# Altium schematic sheet Power.SchDoc
size A4
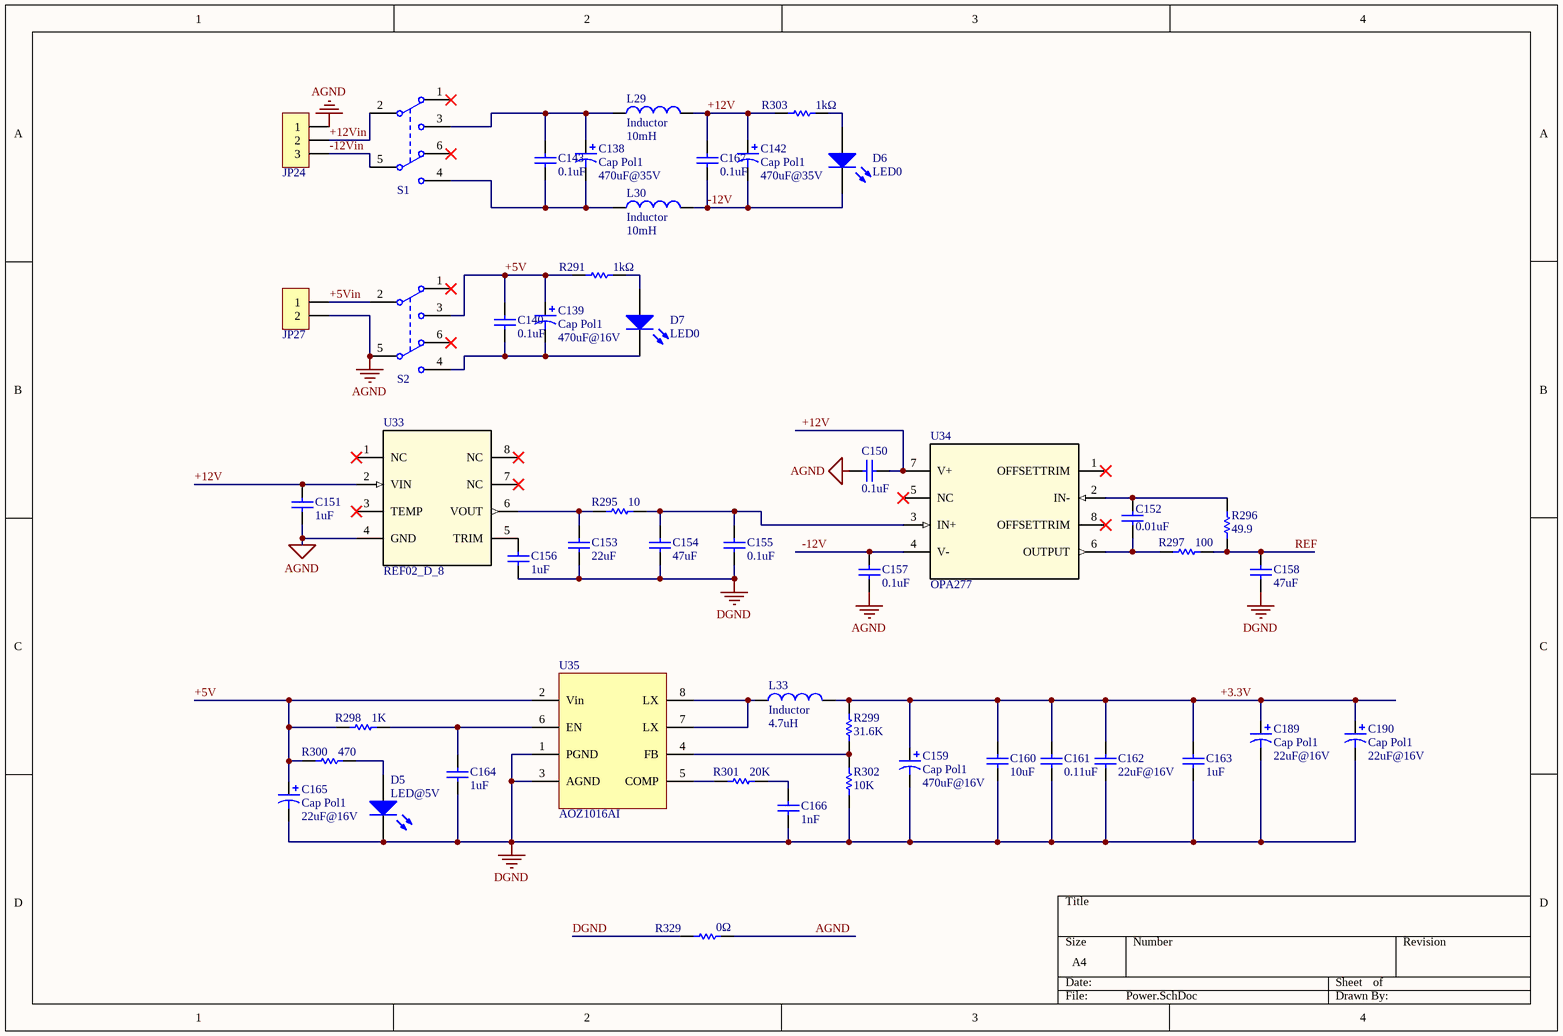
[diagram p0: Power.SchDoc]

## Parts
C138  Cap Pol1  value 470uF@35V  [RB7.6-15]
C139  Cap Pol1  value 470uF@16V  [RB7.6-15]
C140  value 0.1uF  [1608[0603]]  (hidden comment: Cap)
C142  Cap Pol1  value 470uF@35V  [RB7.6-15]
C143  value 0.1uF  [1608[0603]]  (hidden comment: Cap)
C150  value 0.1uF  [1608[0603]]  (hidden comment: Cap)
C151  value 1uF  [1608[0603]]  (hidden comment: Cap)
C152  value 0.01uF  [1608[0603]]  (hidden comment: Cap)
C153  value 22uF  [C0805]  (hidden comment: Cap)
C154  value 47uF  [C1206]  (hidden comment: Cap)
C155  value 0.1uF  [1608[0603]]  (hidden comment: Cap)
C156  value 1uF  [1608[0603]]  (hidden comment: Cap)
C157  value 0.1uF  [1608[0603]]  (hidden comment: Cap)
C158  value 47uF  [C1206]  (hidden comment: Cap)
C159  Cap Pol1  value 470uF@16V  [RB7.6-15]
C160  value 10uF  [1608[0603]]  (hidden comment: Cap)
C161  value 0.11uF  [1608[0603]]  (hidden comment: Cap)
C162  value 22uF@16V  [C0805]  (hidden comment: Cap)
C163  value 1uF  [1608[0603]]  (hidden comment: Cap)
C164  value 1uF  [1608[0603]]  (hidden comment: Cap)
C165  Cap Pol1  value 22uF@16V  [RB5-10.5]
C166  value 1nF  [1608[0603]]  (hidden comment: Cap)
C167  value 0.1uF  [1608[0603]]  (hidden comment: Cap)
C189  Cap Pol1  value 22uF@16V  [RB5-10.5]
C190  Cap Pol1  value 22uF@16V  [RB5-10.5]
D5  LED@5V  [LED-1]
D6  LED0  [LED-0]
D7  LED0  [LED-0]
JP24  HDR-1X3  [KF128-3.81-3P]  (value not drawn)
JP27  HDR-1X2  [KF128-3.81-2P]  (value not drawn)
L29  Inductor  value 10mH  [0402-A]
L30  Inductor  value 10mH  [0402-A]
L33  Inductor  value 4.7uH  [2029]
R291  value 1kΩ  [14-1210]  (hidden comment: Res1)
R295  value 10  [1608[0603]]  (hidden comment: Res1)
R296  value 49.9  [1608[0603]]  (hidden comment: Res1)
R297  value 100  [1608[0603]]  (hidden comment: Res1)
R298  value 1K  [1608[0603]]  (hidden comment: Res1)
R299  value 31.6K  [1608[0603]]  (hidden comment: Res1)
R300  value 470  [1608[0603]]  (hidden comment: Res1)
R301  value 20K  [1608[0603]]  (hidden comment: Res1)
R302  value 10K  [1608[0603]]  (hidden comment: Res1)
R303  value 1kΩ  [14-1210]  (hidden comment: Res1)
R329  value 0Ω  [C2512]  (hidden comment: Res1)
S1  SK-22D02  [SK-22D02]  (value not drawn)
S2  SK-22D02  [SK-22D02]  (value not drawn)
U33  REF02_D_8  [REF02_D_8]
U34  OPA277  [OPA277]
U35  AOZ1016AI  [AOZ1016AI]

## Nets
AGND: C150.1 C151.1 C157.1 JP24.1 JP27.2 R329.1 S2.5 U33.4(GND)
DGND: C153.1 C154.1 C155.1 C156.1 C158.1 C159.2 C160.1 C161.1 C162.1 C163.1 C164.1 C165.2 C166.1 C189.2 C190.2 D5.2(K) R302.2 R329.2 U35.1(PGND) U35.3(AGND)
+3.3V: C159.1 C160.2 C161.2 C162.2 C163.2 C189.1 C190.1 L33.2 R299.1
+5V: C139.1 C140.2 C165.1 R291.1 R298.2 R300.2 S2.3 U35.2(Vin)
+5Vin: JP27.1 S2.2
+12V: C142.1 C150.2 C151.2 C167.2 L29.2 R303.1 U33.2(VIN) U34.7(V+)
+12Vin: JP24.2 S1.2
-12V: C142.2 C157.2 C167.1 D6.2(K) L30.2 U34.4(V-)
-12Vin: JP24.3 S1.5
REF: C158.2 R296.1 R297.1
NetC138_1: C138.1 C143.2 L29.1 S1.3
NetC138_2: C138.2 C143.1 L30.1 S1.4
NetC139_2: C139.2 C140.1 D7.2(K) S2.4
NetC152_1: C152.1 R297.2 U34.6(OUTPUT)
NetC152_2: C152.2 R296.2 U34.2(IN-)
NetC153_2: C153.2 R295.2 U33.6(VOUT)
NetC154_2: C154.2 C155.2 R295.1 U34.3(IN+)
NetC156_2: C156.2 U33.5(TRIM)
NetC164_2: C164.2 R298.1 U35.6(EN)
NetC166_2: C166.2 R301.1
NetD5_1: D5.1(A) R300.1
NetD6_1: D6.1(A) R303.2
NetD7_1: D7.1(A) R291.2
NetL33_1: L33.1 U35.7(LX) U35.8(LX)
NetR299_2: R299.2 R302.1 U35.4(FB)
NetR301_2: R301.2 U35.5(COMP)

Not connected (* = marked no-connect by the designer): S1 1* 6*; S2 1* 6*; U33 1(NC)* 3(TEMP)* 7(NC)* 8(NC)*; U34 1(OFFSETTRIM)* 5(NC)* 8(OFFSETTRIM)*

## Library data of the parts
C138 C139 C142 C159 C165 C189 C190 = Cap Pol1: Polarized Capacitor (Radial); Published: 8-Jun-2000; LatestRevisionDate: 17-Jul-2002; LatestRevisionNote: Re-released for DXP Platform.; PackageReference: RB7.6-15; Publisher: Altium Limited; PackageDescription: Polarized Capacitor (Radial); 2 Leads
C140 C143 C150-C158 C160-C164 C166 C167 = Cap: Capacitor; Published: 8-Jun-2000; LatestRevisionDate: 17-Jul-2002; LatestRevisionNote: Re-released for DXP Platform.; PackageReference: RAD-0.3; Publisher: Altium Limited; PackageDescription: Radial Cap, Thru-Hole; 2 Leads; 0.3 in Pin Spacing
D5 = LED3: Typical BLUE SiC LED; Published: 8-Jun-2000; LatestRevisionDate: 17-Dec-2003; LatestRevisionNote: PCB Footprint replaced.; DatasheetVersion: 16-Apr-2002; PackageVersion: 16-Apr-2002; PackageReference: 3.5X2.8X1.9; Publisher: Altium Limited; PackageDescription: SM LED; 2 C-Bend Leads; Body 3.5 x 2.8 x 1.9 mm, inc leads (LxWxH typ)
D6 D7 = LED0: Typical INFRARED GaAs LED; Published: 8-Jun-2000; LatestRevisionDate: 08-Jul-2005; LatestRevisionNote: Mech Layer 1 removed.; PackageReference: LED-0; Publisher: Altium Limited; PackageDescription: LED; 2 Leads
JP24 = Header 3: 3P接插件; 版权归属: 源创客; BOM名称: 3P接插件; 学习资源: www.ooocke.com
JP27 = Header 2: 2P接插件; 版权归属: 源创客; BOM名称: 2P接插件; 学习资源: www.ooocke.com
L29 L30 L33 = Inductor: Code_IEC: 1005; Published: 8-Jun-2000; LatestRevisionDate: 29-May-2009; LatestRevisionNote: IPC-7351 Footprint Added.; PackageReference: 0402-A; Publisher: Altium Limited; PackageDescription: Chip Inductor; Code_JEITA: 0402
R291 R295-R303 R329 = Res1: Resistor; Published: 8-Jun-2000; LatestRevisionDate: 17-Jul-2002; LatestRevisionNote: Re-released for DXP Platform.; PackageReference: AXIAL-0.3; Publisher: Altium Limited; PackageDescription: Axial Device, Thru-Hole; 2 Leads; 0.3 in Pin Spacing
S1 S2 = SSW-2P: 2路波动开关; BOM名称: 波动开关; 版权归属: 源创客; 学习资源: www.ooocke.com
U33 = REF02_D_8: Manufacturer: Texas Instruments; GENERIC_PART_NUMBER: REF02; INDUSTRY_STD_PKG_TYPE: SOIC; FAMILY_NAME: SERIES VOLTAGE REFERENCE; PIN_COUNT: 8; PACKAGE_DESIGNATOR: D; Datasheet_URL: http://www.ti.com/lit/gpn/REF02; Vendor: Texas Instruments; Manufacturer_Part_Number: ref02_d_8; Value: Value; Type: Type; RefDes: RefDes
U34 = OPA277: Manufacturer: Texas Instruments; Manufacturer_Part_Number: opa277_d_8; INDUSTRY_STD_PKG_TYPE: SOIC; FAMILY_NAME: LOW OFFSET VOLTAGE; PIN_COUNT: 8; PACKAGE_DESIGNATOR: D; Datasheet_URL: http://www.ti.com/lit/gpn/OPA277; GENERIC_PART_NUMBER: OPA277; Vendor: Texas Instruments; Value: Value; Type: Type; RefDes: RefDes